# EAGLE design Dual_Power_Supply (EAGLE 9.6.2)
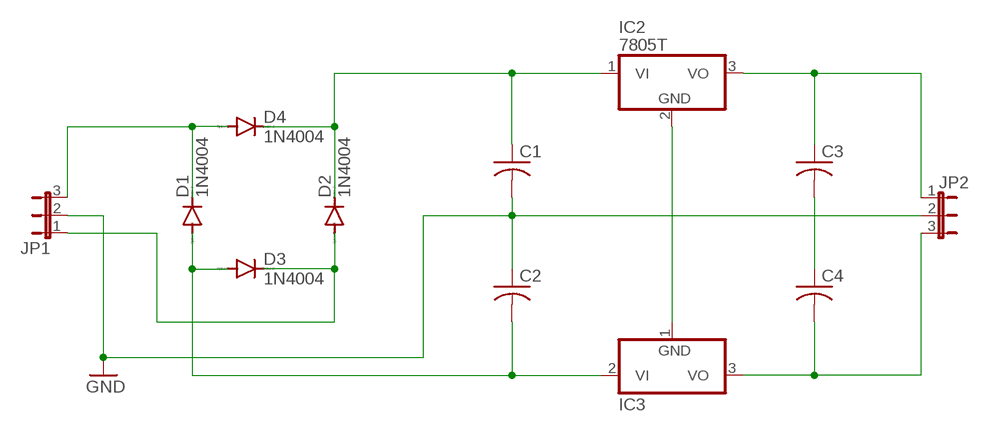
[diagram p0: schematic, sheet 1]

## Parts
C1  C-US025-025X050  [C025-025X050]
C2  C-US025-025X050  [C025-025X050]
C3  C-US025-025X050  [C025-025X050]
C4  C-US025-025X050  [C025-025X050]
D1  1N4004  [DO41-10]
D2  1N4004  [DO41-10]
D3  1N4004  [DO41-10]
D4  1N4004  [DO41-10]
IC2  7805T  [TO220H]
IC3  7905T  [TO220H]
JP1  JP2E  [JP2]
JP2  JP2E  [JP2]

## Nets
GND: C1.2 C2.1 JP1.2 JP2.2
N$1: D1.C D4.A JP1.3
N$2: C2.2 D1.A D3.A IC3.2(VI)
N$3: C1.1 D2.C D4.C IC2.1(VI)
N$4: D2.A D3.C JP1.1
N$6: C3.1 IC2.3(VO) JP2.1
N$7: IC2.2(GND) IC3.1(GND)
N$8: C3.2 C4.1
N$9: C4.2 IC3.3(VO) JP2.3

## Library data of the parts
C1-C4 = rcl:C-US: CAPACITOR, American symbol; SPICEPREFIX: C
D1-D4 = diode:1N4004: DIODE general purpose rectifier, 1 A
IC2 = linear:78*: Positive VOLTAGE REGULATOR Source: http://cache.national.com/ds/LM/LM78L05.pdf http://www.fairchildsemi.com/ds/LM/LM7805.pdf
IC3 = linear:79*: Negative VOLTAGE REGULATOR
JP1 JP2 = jumper:JP2E: JUMPER

## Board
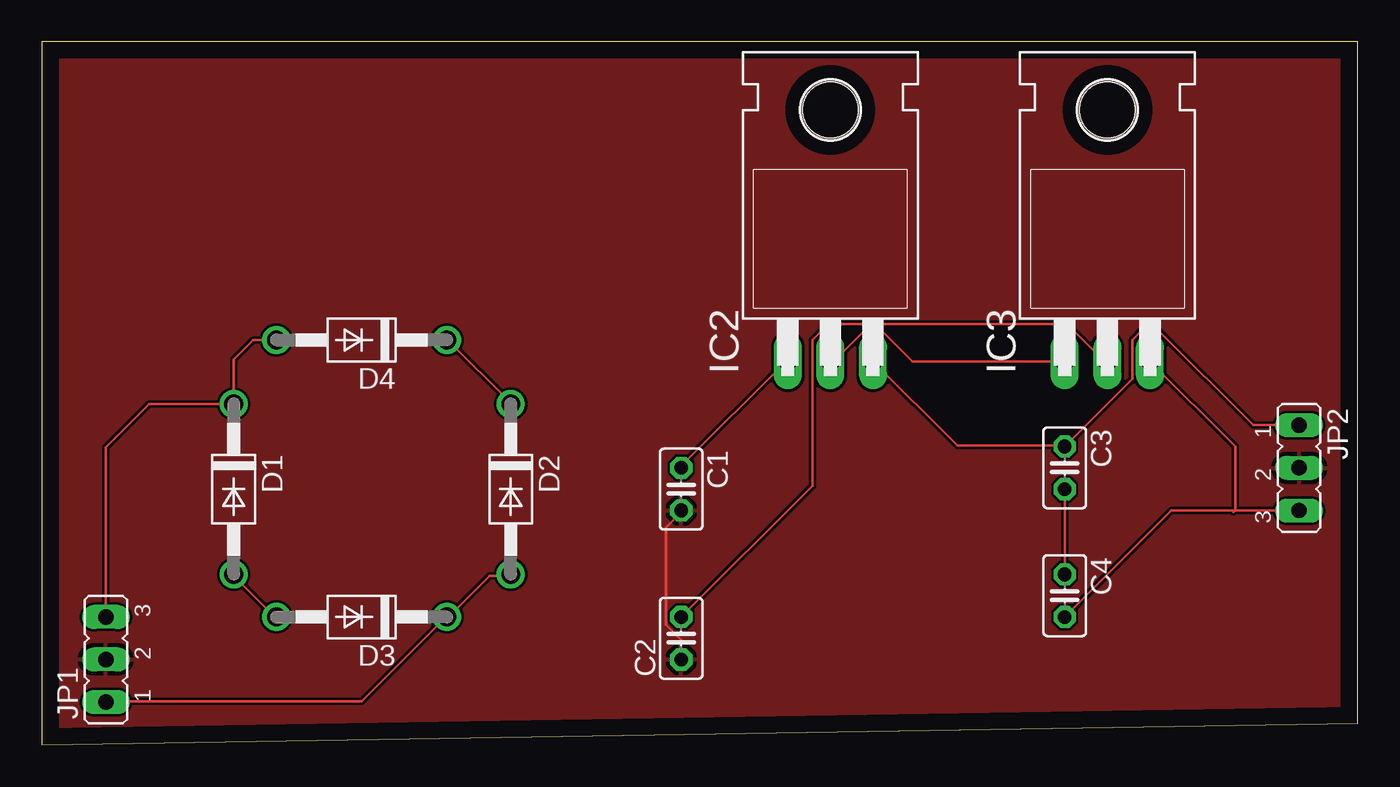
[diagram p1: board, top side]
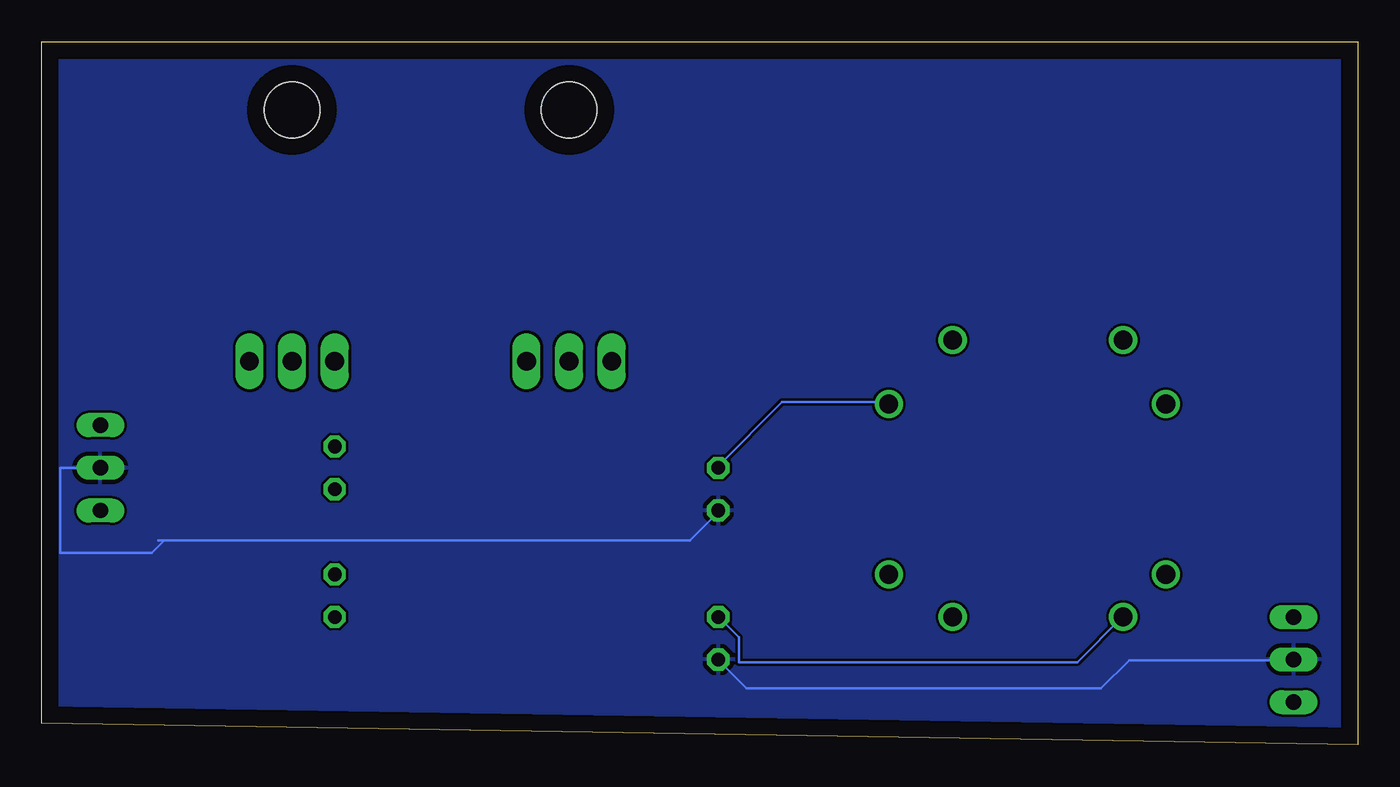
[diagram p2: board, bottom side, seen from below]

Size 78.41 x 41.9 mm. Coordinates in mm from the lower left corner, seen from the top.
Outline: 0,0 78.41,1.27 78.41,41.9 0,41.9 0,0
Copper layers (1*16): Top 0.035mm / dielectric 1.5mm / Bottom 0.035mm
Design rules "default": minimum track width 6mil, minimum drill 0.35mm, track to track 6mil, track to pad 6mil, pad to pad 6mil, via to via 6mil, smd to smd 6mil, copper to edge 40mil, drill to drill 6mil, minimum pad ring 10mil, minimum via ring 8mil, stop-mask expansion 4mil, vias tented up to drill 0mil, thermal gap 10mil

### Footprints (pad centres in the part's own frame; a part is rotated, then mirrored left to right if it is on the bottom)
C025-025X050 = drill 0.813 octagon: 1 -1.27,0; 2 1.27,0
DO41-10 = drill 1.118: A 5.08,0; C -5.08,0
TO220H = drill 1.118 long: 1 -2.54,-10.16; 2 0,-10.16; 3 2.54,-10.16 | hole 3.302: 0,4.826
JP2 = drill 0.914 long: 1 -2.54,0; 2 0,0; 3 2.54,0

### Placement (x,y rotation side)
C1  38.1,15.24 270 top
C2  38.1,6.35 90 top
C3  60.96,16.51 270 top
C4  60.96,8.89 270 top
D1  11.43,15.24 270 top
D2  27.94,15.24 270 top
D3  19.05,7.62 180 top
D4  19.05,24.13 180 top
IC2  46.99,33.02 0 top
IC3  63.5,33.02 0 top
JP1  3.81,5.08 90 top
JP2  74.93,16.51 270 top

### Tracks (layer width: path | path; a pad name or v marks a point on that pad's centre or on a via)
GND
  Top 0.152: C2.1 38.1,6.25 37.19,7.16 37.19,12.95 38.1,13.87 C1.2
  Bottom 0.152: JP1.2 3.81,5.03 13.61,5.03 15.29,3.35 36.42,3.35 38.1,5.03 C2.1 | 71.12,12.19 39.78,12.19 38.1,13.87 C1.2 | 71.12,12.19 71.48,12.19 | 74.97,16.41 JP2.2 77.32,16.51 77.32,11.43 71.88,11.43 71.12,12.19
  pour Top: -1.27,43.18 78.74,43.18 81.28,40.64 81.28,1.27 78.74,-1.27 0,-1.27 -1.27,0
  pour Bottom: -2.54,44.45 -2.54,-1.27 0,-3.81 78.74,-3.81 83.82,1.27 83.82,40.64 80.01,44.45
N$1
  Top 0.152: JP1.3 3.81,17.73 6.4,20.32 D1.C 11.43,22.96 12.6,24.13 D4.A
N$2
  Top 0.152: D3.A 13.87,7.62 11.43,10.06 D1.A | IC3.2 63.31,22.86 61.1,25.07 46.85,25.07 45.92,24.14 45.92,15.44 C2.2
  Bottom 0.152: C2.2 36.88,6.4 36.88,4.93 16.71,4.93 14.02,7.62 D3.A
N$3
  Top 0.152: D4.C 24.23,24.08 27.89,20.42 D2.C | C1.1 38.1,16.61 44.35,22.86 IC2.1
  Bottom 0.152: D2.C 28.04,20.42 34.29,20.42 38.1,16.61 C1.1
N$4
  Top 0.152: JP1.1 3.81,2.59 19.05,2.59 24.08,7.62 D3.C 24.23,7.62 26.67,10.06 27.89,10.06 D2.A
N$6
  Top 0.152: IC2.3 54.56,17.83 60.96,17.83 C3.1 | 60.96,17.68 C3.1 | JP2.1 72.2,19.05 66.48,24.77 65.6,24.77 64.97,24.14 64.97,21.79 C3.1
N$7
  Top 0.152: IC2.2 47.18,22.86 49.09,24.77 49.97,24.77 51.88,22.86 IC3.1
N$8
  Top 0.152: C3.2 C4.1
N$9
  Top 0.152: 71.02,13.87 71.12,13.97 | C4.2 67.31,13.97 71.12,13.97 | JP2.3 71.12,13.97 | 71.12,13.97 71.12,17.78 IC3.3

### Text on the board
tValues: CDAC-HYD